# Altium schematic sheet Connector (DESKTOP-GM7ATB6's conflicted copy 2018-08-09).SchDoc
size A4; Author: Shohei Aoki; Organization: Shokara Inc.; Address1: Yokohama, Japan
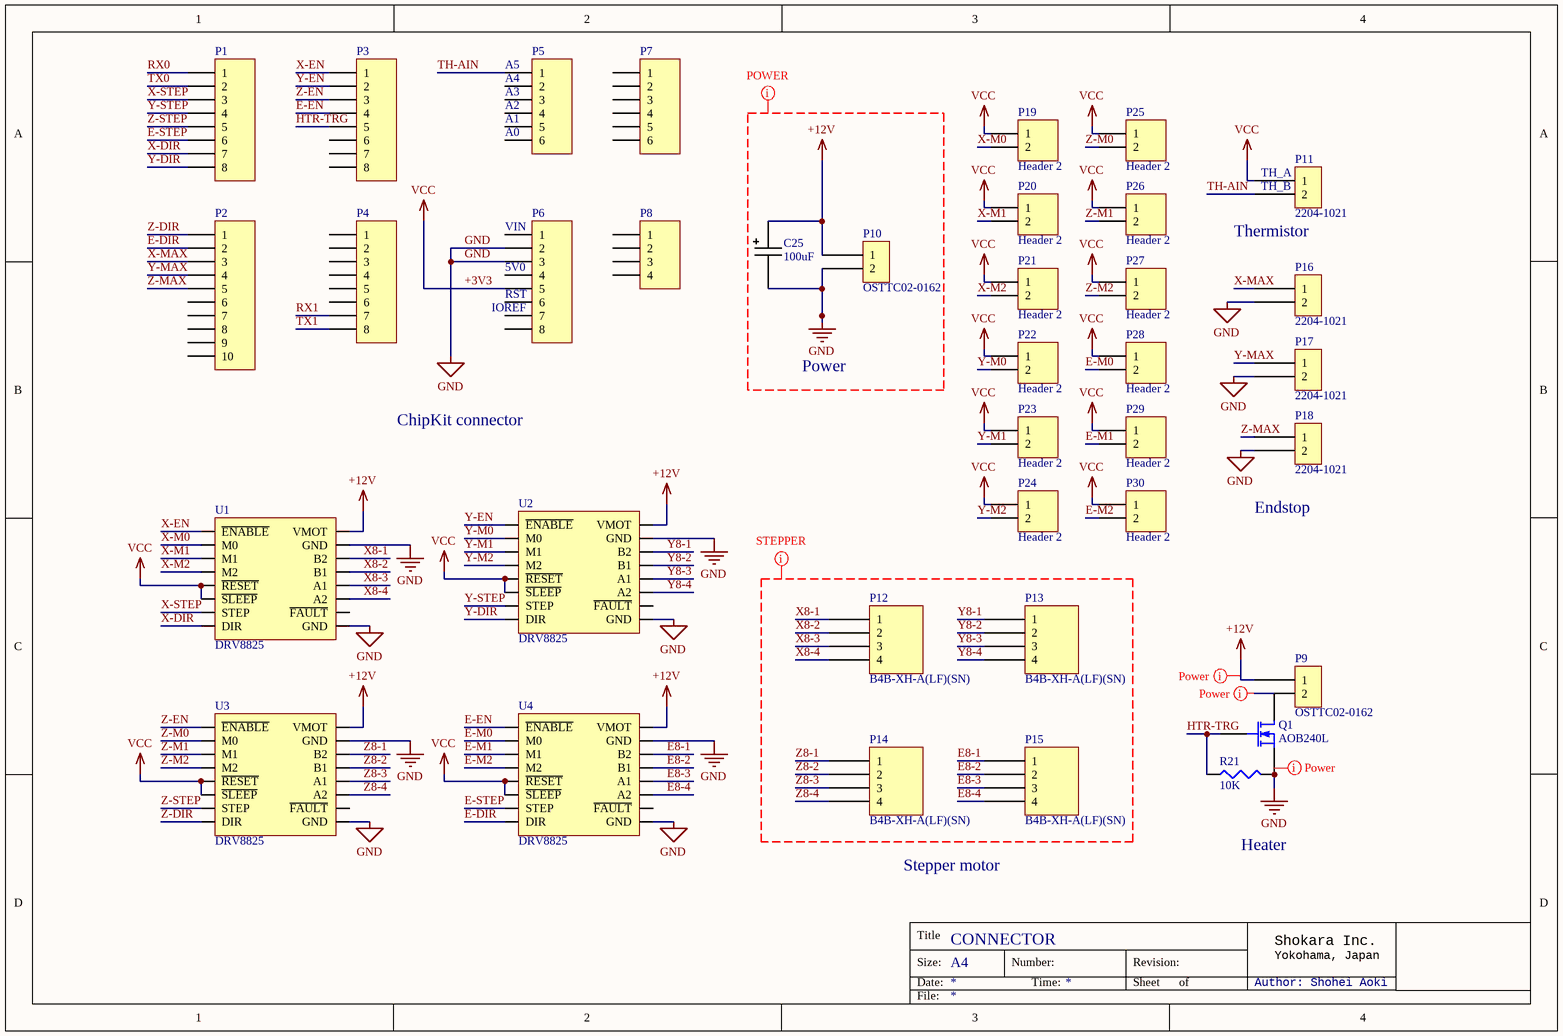
[diagram p0: Connector (DESKTOP-GM7ATB6's conflicted copy 2018-08-09).SchDoc]

## Parts
C25  *  [EEE-1HA470XP]  (value not drawn)
P1  (no value)  [HDR1X8]
P2  (no value)  [HDR1X10]
P3  (no value)  [HDR1X8]
P4  (no value)  [HDR1X8]
P5  (no value)  [HDR1X6]
P6  (no value)  [HDR1X8]
P7  (no value)  [HDR1X6]
P8  (no value)  [HDR1X4]
P9  OSTTC02-0162  [OSTTC02-0162]
P10  OSTTC02-0162  [OSTTC02-0162]
P11  2204-1021  [MOLEX_2204_1021]
P12  B4B-XH-A(LF)(SN)  [B4B-XH-A]
P13  B4B-XH-A(LF)(SN)  [B4B-XH-A]
P14  B4B-XH-A(LF)(SN)  [B4B-XH-A]
P15  B4B-XH-A(LF)(SN)  [B4B-XH-A]
P16  2204-1021  [MOLEX_2204_1021]
P17  2204-1021  [MOLEX_2204_1021]
P18  2204-1021  [MOLEX_2204_1021]
P19  Header 2  [HDR1X2]
P20  Header 2  [HDR1X2]
P21  Header 2  [HDR1X2]
P22  Header 2  [HDR1X2]
P23  Header 2  [HDR1X2]
P24  Header 2  [HDR1X2]
P25  Header 2  [HDR1X2]
P26  Header 2  [HDR1X2]
P27  Header 2  [HDR1X2]
P28  Header 2  [HDR1X2]
P29  Header 2  [HDR1X2]
P30  Header 2  [HDR1X2]
Q1  AOB240L  [DPAK254P1524X483-3N]
R21  value 10K  [J1-0603]
U1  DRV8825  [DRV8825]
U2  DRV8825  [DRV8825]
U3  DRV8825  [DRV8825]
U4  DRV8825  [DRV8825]

## Nets
+3V3: P6.5 P11.1 P19.1 P20.1 P21.1 P22.1 P23.1 P24.1 P25.1 P26.1 P27.1 P28.1 P29.1 P30.1 U1.RESET(~{RESET}) U1.SLEEP(~{SLEEP}) U2.RESET(~{RESET}) U2.SLEEP(~{SLEEP}) U3.RESET(~{RESET}) U3.SLEEP(~{SLEEP}) U4.RESET(~{RESET}) U4.SLEEP(~{SLEEP})  [also labelled VCC]
+12V: C25.2 P9.1 P10.1 U1.VMOT U2.VMOT U3.VMOT U4.VMOT
GND: C25.1 P6.2 P6.3 P10.2 P16.2 P17.2 P18.2 Q1.3(S) R21.2 U1.GND U2.GND U3.GND U4.GND
E8-1: P15.1 U4.B2
E8-2: P15.2 U4.B1
E8-3: P15.3 U4.A1
E8-4: P15.4 U4.A1(A2)
E-DIR: P2.2 U4.DIR
E-EN: P3.4 U4.ENABLE(~{ENABLE})
E-M0: P28.2 U4.M0
E-M1: P29.2 U4.M1
E-M2: P30.2 U4.M2
E-STEP: P1.6 U4.STEP
HTR-TRG: P3.5 Q1.1(G) R21.1
RX0: P1.1
RX1: P4.7
TH-AIN: P5.1 P11.2
TX0: P1.2
TX1: P4.8
X8-1: P12.1 U1.B2
X8-2: P12.2 U1.B1
X8-3: P12.3 U1.A1
X8-4: P12.4 U1.A1(A2)
X-DIR: P1.7 U1.DIR
X-EN: P3.1 U1.ENABLE(~{ENABLE})
X-M0: P19.2 U1.M0
X-M1: P20.2 U1.M1
X-M2: P21.2 U1.M2
X-MAX: P2.3 P16.1
X-STEP: P1.3 U1.STEP
Y8-1: P13.1 U2.B2
Y8-2: P13.2 U2.B1
Y8-3: P13.3 U2.A1
Y8-4: P13.4 U2.A1(A2)
Y-DIR: P1.8 U2.DIR
Y-EN: P3.2 U2.ENABLE(~{ENABLE})
Y-M0: P22.2 U2.M0
Y-M1: P23.2 U2.M1
Y-M2: P24.2 U2.M2
Y-MAX: P2.4 P17.1
Y-STEP: P1.4 U2.STEP
Z8-1: P14.1 U3.B2
Z8-2: P14.2 U3.B1
Z8-3: P14.3 U3.A1
Z8-4: P14.4 U3.A1(A2)
Z-DIR: P2.1 U3.DIR
Z-EN: P3.3 U3.ENABLE(~{ENABLE})
Z-M0: P25.2 U3.M0
Z-M1: P26.2 U3.M1
Z-M2: P27.2 U3.M2
Z-MAX: P2.5 P18.1
Z-STEP: P1.5 U3.STEP
NetP9_2: P9.2 Q1.4(D)

Not connected (* = marked no-connect by the designer): P2 6 7 8 9 10; P3 6 7 8; P4 1 2 3 4 5 6; P5 2 3 4 5 6; P6 1 4 6 7 8; P7 1 2 3 4 5 6; P8 1 2 3 4; Q1 2(NC); U1 FAULT(~{FAULT}); U2 FAULT(~{FAULT}); U3 FAULT(~{FAULT}); U4 FAULT(~{FAULT})

## Layout directives
net class Power: (no net found under the mark), +12V, GND, NetP9_2
net class Stepper: E8-1, E8-2, E8-3, E8-4, X8-1, X8-2, X8-3, X8-4, Y8-1, Y8-2, Y8-3, Y8-4, Z8-1, Z8-2, Z8-3, Z8-4

## Notes on the sheet
- (near P5) A5
- (near P5) A4
- (near P5) A3
- (near P5) A2
- (near P5) A1
- (near P5) A0
- (near P11) TH_A
- (near P6) VIN
- (near P11) Thermistor
- (near P11) TH_B
- (near P6) IOREF
- (near P6) 5V0
- (near P6) RST
- Power
- ChipKit connector
- (near P18) Endstop
- Heater
- Stepper motor
- CONNECTOR
- Title
- Size:
- Date:
- Number:
- Time:
- Revision:
- Sheet
- of
- Author: Shohei Aoki
- Shokara Inc.
- Yokohama, Japan
- File:
- (in symbol Cap_alumi_electrolytic) 100uF

## Library data of the parts
C25 = Cap_alumi_electrolytic
P1 P3 P4 P6 = Header 8: Header, 8-Pin; LatestRevisionDate: 17-Jul-2002; LatestRevisionNote: Re-released for DXP Platform.; Publisher: Altium Limited
P2 = Header 10: Header, 10-Pin; LatestRevisionDate: 17-Jul-2002; LatestRevisionNote: Re-released for DXP Platform.; Publisher: Altium Limited
P5 P7 = Header 6: Header, 6-Pin; LatestRevisionDate: 17-Jul-2002; LatestRevisionNote: Re-released for DXP Platform.; Publisher: Altium Limited
P8 = Header 4: Header, 4-Pin; LatestRevisionDate: 17-Jul-2002; LatestRevisionNote: Re-released for DXP Platform.; Publisher: Altium Limited
P9 P10 = TERMINAL_BLOCK_1X2
P11 P16-P18 = MOLEX_1X2_HEADER
P12-P15 = XH_CONNECTOR_1X4
P19-P30 = Header 2: Header, 2-Pin; LatestRevisionDate: 17-Jul-2002; LatestRevisionNote: Re-released for DXP Platform.; Publisher: Altium Limited
R21 = Res3: Resistor; Published: 8-Jun-2000; LatestRevisionDate: 29-May-2009; LatestRevisionNote: IPC-7351 Footprint Added.; PackageReference: J1-0603; Publisher: Altium Limited; PackageDescription: Chip Resistor